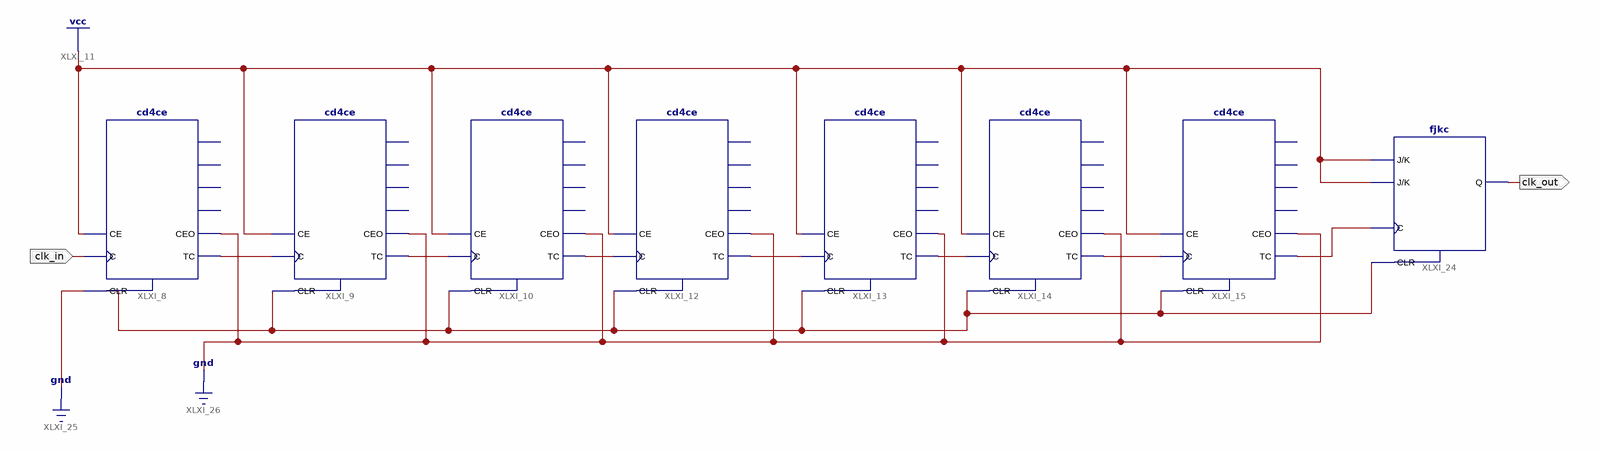
[diagram p0: schematic sheet 1]
// Xilinx ISE schematic counter1HZ.sch (spartan6) as structural Verilog: 8 symbols, 2 ports
module counter1HZ (
  input  clk_in,
  output clk_out
);

  wire XLXN_8, XLXN_9, XLXN_14, XLXN_15, XLXN_16, XLXN_17, XLXN_43;

  cd4ce XLXI_8 (.C(clk_in), .CE(1'b1), .CLR(1'b0), .CEO(1'b0), .TC(XLXN_8));  // open: Q0, Q1, Q2, Q3
  cd4ce XLXI_9 (.C(XLXN_8), .CE(1'b1), .CLR(1'b0), .CEO(1'b0), .TC(XLXN_9));  // open: Q0, Q1, Q2, Q3
  cd4ce XLXI_10 (.C(XLXN_9), .CE(1'b1), .CLR(1'b0), .CEO(1'b0), .TC(XLXN_14));  // open: Q0, Q1, Q2, Q3
  cd4ce XLXI_12 (.C(XLXN_14), .CE(1'b1), .CLR(1'b0), .CEO(1'b0), .TC(XLXN_15));  // open: Q0, Q1, Q2, Q3
  cd4ce XLXI_13 (.C(XLXN_15), .CE(1'b1), .CLR(1'b0), .CEO(1'b0), .TC(XLXN_16));  // open: Q0, Q1, Q2, Q3
  cd4ce XLXI_14 (.C(XLXN_16), .CE(1'b1), .CLR(1'b0), .CEO(1'b0), .TC(XLXN_17));  // open: Q0, Q1, Q2, Q3
  cd4ce XLXI_15 (.C(XLXN_17), .CE(1'b1), .CLR(1'b0), .CEO(1'b0), .TC(XLXN_43));  // open: Q0, Q1, Q2, Q3
  fjkc XLXI_24 (.C(XLXN_43), .CLR(1'b0), .J(1'b1), .K(1'b1), .Q(clk_out));
endmodule
